# Altium schematic sheet P09_Audio Connections.SchDoc
size A; SheetNumber: 8; SheetTotal: 8
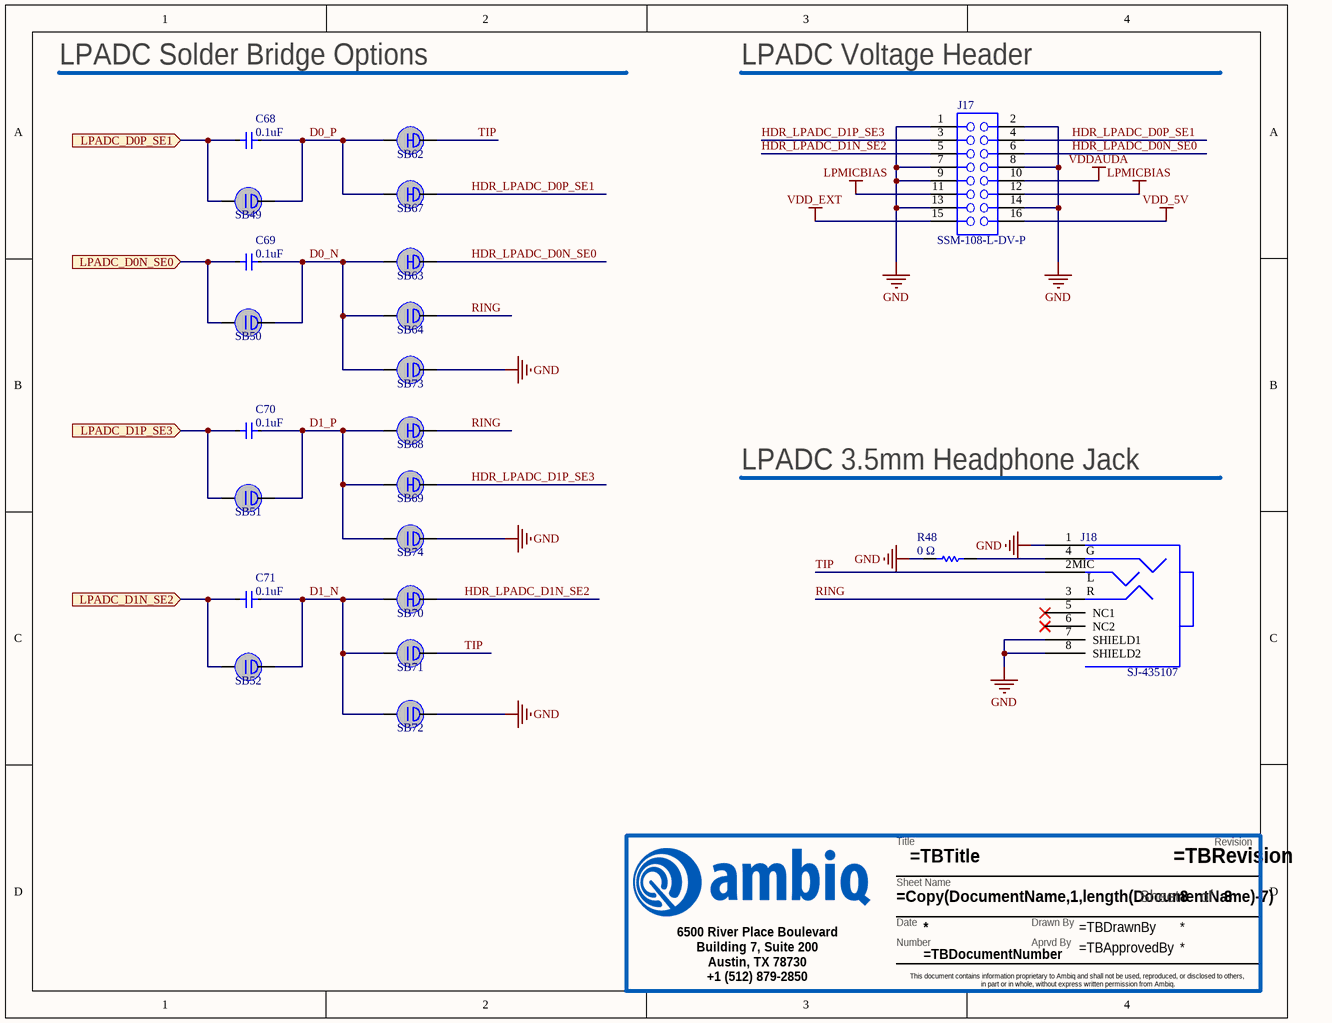
[diagram p0: P09_Audio Connections.SchDoc]

## Parts
?  TitleBlock  (value not drawn)  (graphical)
C68  0.1uF  [IPC_A]
C69  0.1uF  [IPC_A]
C70  0.1uF  [IPC_A]
C71  0.1uF  [IPC_A]
J17  SSM-108-L-DV-P  [SSM-108-X-DV-P]
J18  SJ-435107  [JACK_STEREO_RA_SJ-435107]
R48  0 Ω  [IPC_A]
SB49  Solderbridge  [SB39X18]  (value not drawn)  (no BOM)
SB50  Solderbridge  [SB39X18]  (value not drawn)  (no BOM)
SB51  Solderbridge  [SB39X18]  (value not drawn)  (no BOM)
SB52  Solderbridge  [SB39X18]  (value not drawn)  (no BOM)
SB62  Solder short  [SB39X18_SHORTED]  (value not drawn)  (net tie, no BOM)
SB63  Solder short  [SB39X18_SHORTED]  (value not drawn)  (net tie, no BOM)
SB64  Solderbridge  [SB39X18]  (value not drawn)  (no BOM)
SB67  Solder short  [SB39X18_SHORTED]  (value not drawn)  (net tie, no BOM)
SB68  Solder short  [SB39X18_SHORTED]  (value not drawn)  (net tie, no BOM)
SB69  Solder short  [SB39X18_SHORTED]  (value not drawn)  (net tie, no BOM)
SB70  Solder short  [SB39X18_SHORTED]  (value not drawn)  (net tie, no BOM)
SB71  Solderbridge  [SB39X18]  (value not drawn)  (no BOM)
SB72  Solderbridge  [SB39X18]  (value not drawn)  (no BOM)
SB73  Solderbridge  [SB39X18]  (value not drawn)  (no BOM)
SB74  Solderbridge  [SB39X18]  (value not drawn)  (no BOM)

## Ports
LPADC_D0N_SE0 (in), LPADC_D0P_SE1 (in), LPADC_D1N_SE2 (in), LPADC_D1P_SE3 (in)

## Nets
GND: J17.1(A1) J17.2(B1) J17.7(A4) J17.8(B4) J17.9(A5) J17.13(A7) J17.14(B7) J18.1(G) J18.7(SHIELD1) J18.8(SHIELD2) R48.1 SB72.2 SB73.2 SB74.2
LPMICBIAS: J17.11(A6) J17.12(B6)
VDD_5V: J17.16(B8)
VDD_EXT: J17.15(A8)
VDDAUDA: J17.10(B5)
D0_N: C69.2 SB50.2 SB63.1 SB64.1 SB73.1
D0_P: C68.2 SB49.2 SB62.1 SB67.1
D1_N: C71.2 SB52.2 SB70.1 SB71.1 SB72.1
D1_P: C70.2 SB51.2 SB68.1 SB69.1 SB74.1
HDR_LPADC_D0N_SE0: J17.6(B3) SB63.2
HDR_LPADC_D0P_SE1: J17.4(B2) SB67.2
HDR_LPADC_D1N_SE2: J17.5(A3) SB70.2
HDR_LPADC_D1P_SE3: J17.3(A2) SB69.2
LPADC_D0N_SE0: C69.1 SB50.1 ; port LPADC_D0N_SE0
LPADC_D0P_SE1: C68.1 SB49.1 ; port LPADC_D0P_SE1
LPADC_D1N_SE2: C71.1 SB52.1 ; port LPADC_D1N_SE2
LPADC_D1P_SE3: C70.1 SB51.1 ; port LPADC_D1P_SE3
RING: J18.3(R) SB64.2 SB68.2
TIP: J18.2(L) SB62.2 SB71.2
NetJ18_4: J18.4(MIC) R48.2

Not connected (* = marked no-connect by the designer): J18 5(NC1)* 6(NC2)*

## Notes on the sheet
- LPADC Solder Bridge Options
- LPADC Voltage Header
- LPADC 3.5mm Headphone Jack
- (in symbol TitleBlock) Revision; Title; Sheet Name; Sheet; of; Date; Drawn By; Number; Aprvd By; 6500 River Place Boulevard / Building 7, Suite 200 / Austin, TX 78730 / +1 (512) 879-2850; This document contains information proprietary to Ambiq and shall not be used, reproduced, or disclosed to others, / in part or in whole, without express written permission from Ambiq.

## Library data of the parts
? = TitleBlock: Title block for Ambiq Schematics. Please have the following parameters entered in Project>Project Options>Parameters: / TBTitle / TBDocumentNumber / TBRevision / TBDrawnBy / TBApprovedBy; AMBIQ PN: TitleBlock; DESCRIPTION: Title block for Ambiq Schematics. Please have the following parameters entered in Project>Project Options>Parameters:  TBTitle  TBDocumentNumber  TBRevision  TBDrawnBy  TBApprovedBy
C68-C71 = GRM155R71C104KA88D: NONE; Manufacturer: Murata; Capacitance: 100nF; Tolerance: 10%; Voltage Rating: 16V; Dielectric: X7R; Dielectric Material: Ceramic; Insulation Resistance: 10GR; AMBIQ PN: GRM155R71C104KA88D; Supplier 1: Arrow Electronics; Supplier Part Number 1: GRM155R71C104KA88D; Manufacturer Part Number: GRM155R71C104KA88D; RoHS: Yes; Category: Ceramic Capacitors; Stock 1: 20200000; Pricing 1: 10000=0.00270, 30000=0.00220, 250000=0.00210 (USD); Mount: Surface Mount; Case/Package: 0402; Case Code (Metric): 1005; Case Code (Imperial): 0402; Min Operating Temperature: -55°C; Max Operating Temperature: 125°C; Packaging: Tape and Reel; Voltage: 16V; Voltage Rating (DC): 16V; Length: 1mm; Width: 0.5mm; Height: 0.5mm; Thickness: 0.022inch; Depth: 0.5mm; Radiation Hardening: No; REACH SVHC: No SVHC; Lead Free: Lead Free; RoHS Compliant: Yes; ComponentLink1URL: https://datasheet.ciiva.com/129/grm155r71c104ka88-01-129739.pdf?src-supplier=Digi-Key; ComponentLink1Description: https://datasheet.ciiva.com/129/grm155r71c104ka88-01-129739.pdf?src-supplier=Digi-Key; Package Quantity: 1; Termination: SMD/SMT; Number of Pins: 2; Material: Ceramic; ComponentLink2URL: https://datasheet.ciiva.com/129/grm155r71c104ka88-01-129740.pdf?src-supplier=Digi-Key; ComponentLink2Description: https://datasheet.ciiva.com/129/grm155r71c104ka88-01-129740.pdf?src-supplier=Digi-Key; ComponentLink3URL: https://datasheet.ciiva.com/18102/getdatasheetpartid-85307-18102905.pdf?src-supplier=Verical; ComponentLink3Description: https://datasheet.ciiva.com/18102/getdatasheetpartid-85307-18102905.pdf?src-supplier=Verical
J17 = SSM-108-L-DV: None; Manufacturer: Samtec; Connector Type: Receptacle; Number of Contacts: 16; Pitch: 2.54mm; Max Current Rating: 6.9A; Row Spacing: 0.1inch; Max Voltage Rating (AC): 475V; Contact Resistance: 10mR; AMBIQ PN: SSM-108-L-DV; Supplier 1: Newark; Supplier Part Number 1: 11P7889; Manufacturer Part Number: SSM-108-L-DV; RoHS: Yes; Category: Headers and Wire Housings; Stock 1: 2149; Pricing 1: 1=6.04000, 50=5.23000, 100=4.43000, 500=3.14000, 1000=2.38000 (USD); Contact Material: Bronze; Contact Plating: Gold; Housing Material: Polymer; Min Operating Temperature: -55°C; Max Operating Temperature: 125°C; Packaging: Bulk; Gender: Receptacle; Orientation: Vertical; Termination: Solder; Length: 20.32mm; REACH SVHC: No SVHC; RoHS Compliant: Yes; ComponentLink1URL: https://datasheet.ciiva.com/746/ssm-1xx-xxx-dv-xx-xx-x-xx-mkt-746637.pdf?src-supplier=Digi-Key; ComponentLink1Description: https://datasheet.ciiva.com/746/ssm-1xx-xxx-dv-xx-xx-x-xx-mkt-746637.pdf?src-supplier=Digi-Key; Housing Color: Black; Number of Rows: 2; Number of Positions: 16; Series: SSM; Depth: 5.08mm; Radiation Hardening: No; Color: Black; Contact Type: Female Socket; Lead Free: Lead Free; Width: 5.08mm
J18 = SJ-435107: None; Manufacturer: CUI; Connector Type: Jack; Gender: Female; Number of Ports: 1; Current Rating: 1A; Shielding: Shielded; Voltage Rating: 12V; Body Material: Brass; Body Color: Silver; Number of Conductors: 4; AMBIQ PN: SJ-435107; Supplier 1: Arrow Electronics; Supplier Part Number 1: SJ-435107; Manufacturer Part Number: SJ-435107; RoHS: Yes; Category: Audio / Video Cables; Mount: Through Hole; Contact Plating: Tin; Packaging: Bulk; Orientation: Horizontal; Termination: Solder; RoHS Compliant: Yes; ComponentLink1URL: https://www.cui.com/product/resource/digikeypdf/sj-435107.pdf?src-supplier=Digi-Key; ComponentLink1Description: https://www.cui.com/product/resource/digikeypdf/sj-435107.pdf?src-supplier=Digi-Key; Series: SJ; Color: Black; Lead Free: Lead Free
R48 = ERJ-1GN0R00C: ERJ Series 0201 0 Ohm 0.05 W Jumper Surface Mount Thick Film Chip Resistor; Manufacturer: Panasonic; Resistance: 0R; Power Rating: 50mW; Voltage Rating: 25V; Temperature Coefficient: 600ppm/°C; Tolerance: 1%; AMBIQ PN: ERJ-1GN0R00C; Supplier 1: RSComponents; Supplier Part Number 1: 1755716; Manufacturer Part Number: ERJ-1GN0R00C; RoHS: Yes; Category: Chip SMD Resistors; Stock 1: 577637; Pricing 1: 15000=0.00500 (GBP); Mount: Surface Mount; Case/Package: 0201; Case Code (Metric): 0603; Case Code (Imperial): 0201; Contact Plating: Tin; Min Operating Temperature: -55°C; Max Operating Temperature: 125°C; Package Quantity: 15000; Packaging: Tape and Reel; Resistor Type: Thick Film; Number of Terminations: 2; Max Power Dissipation: 50mW; Voltage Rating (DC): 25V; Features: Automotive AEC-Q200; Series: ERJ; Construction: Rectangular; Length: 0.6mm; Width: 0.3mm; Height: 0.23mm; Depth: 0.3mm
SB49-SB52 SB64 SB71-SB74 = SBO: None; AMBIQ PN: SBO
SB62 SB63 SB67-SB70 = SBS: None; AMBIQ PN: SBS